# EasyEDA Pro project EasyEDA file.epro

# Schematic Schematic1
Board Name: Board1; Create Date: 2025-11-25; Page Name: P1; Project Name: Robodog; Schematic Name: Schematic1; Update Date: 2025-11-26; Company: there are too many boxes idk what to write here; Drawn: by Sahas; Page Size: Blueprint; Reviewed: by Hack Club; Version: V1.0
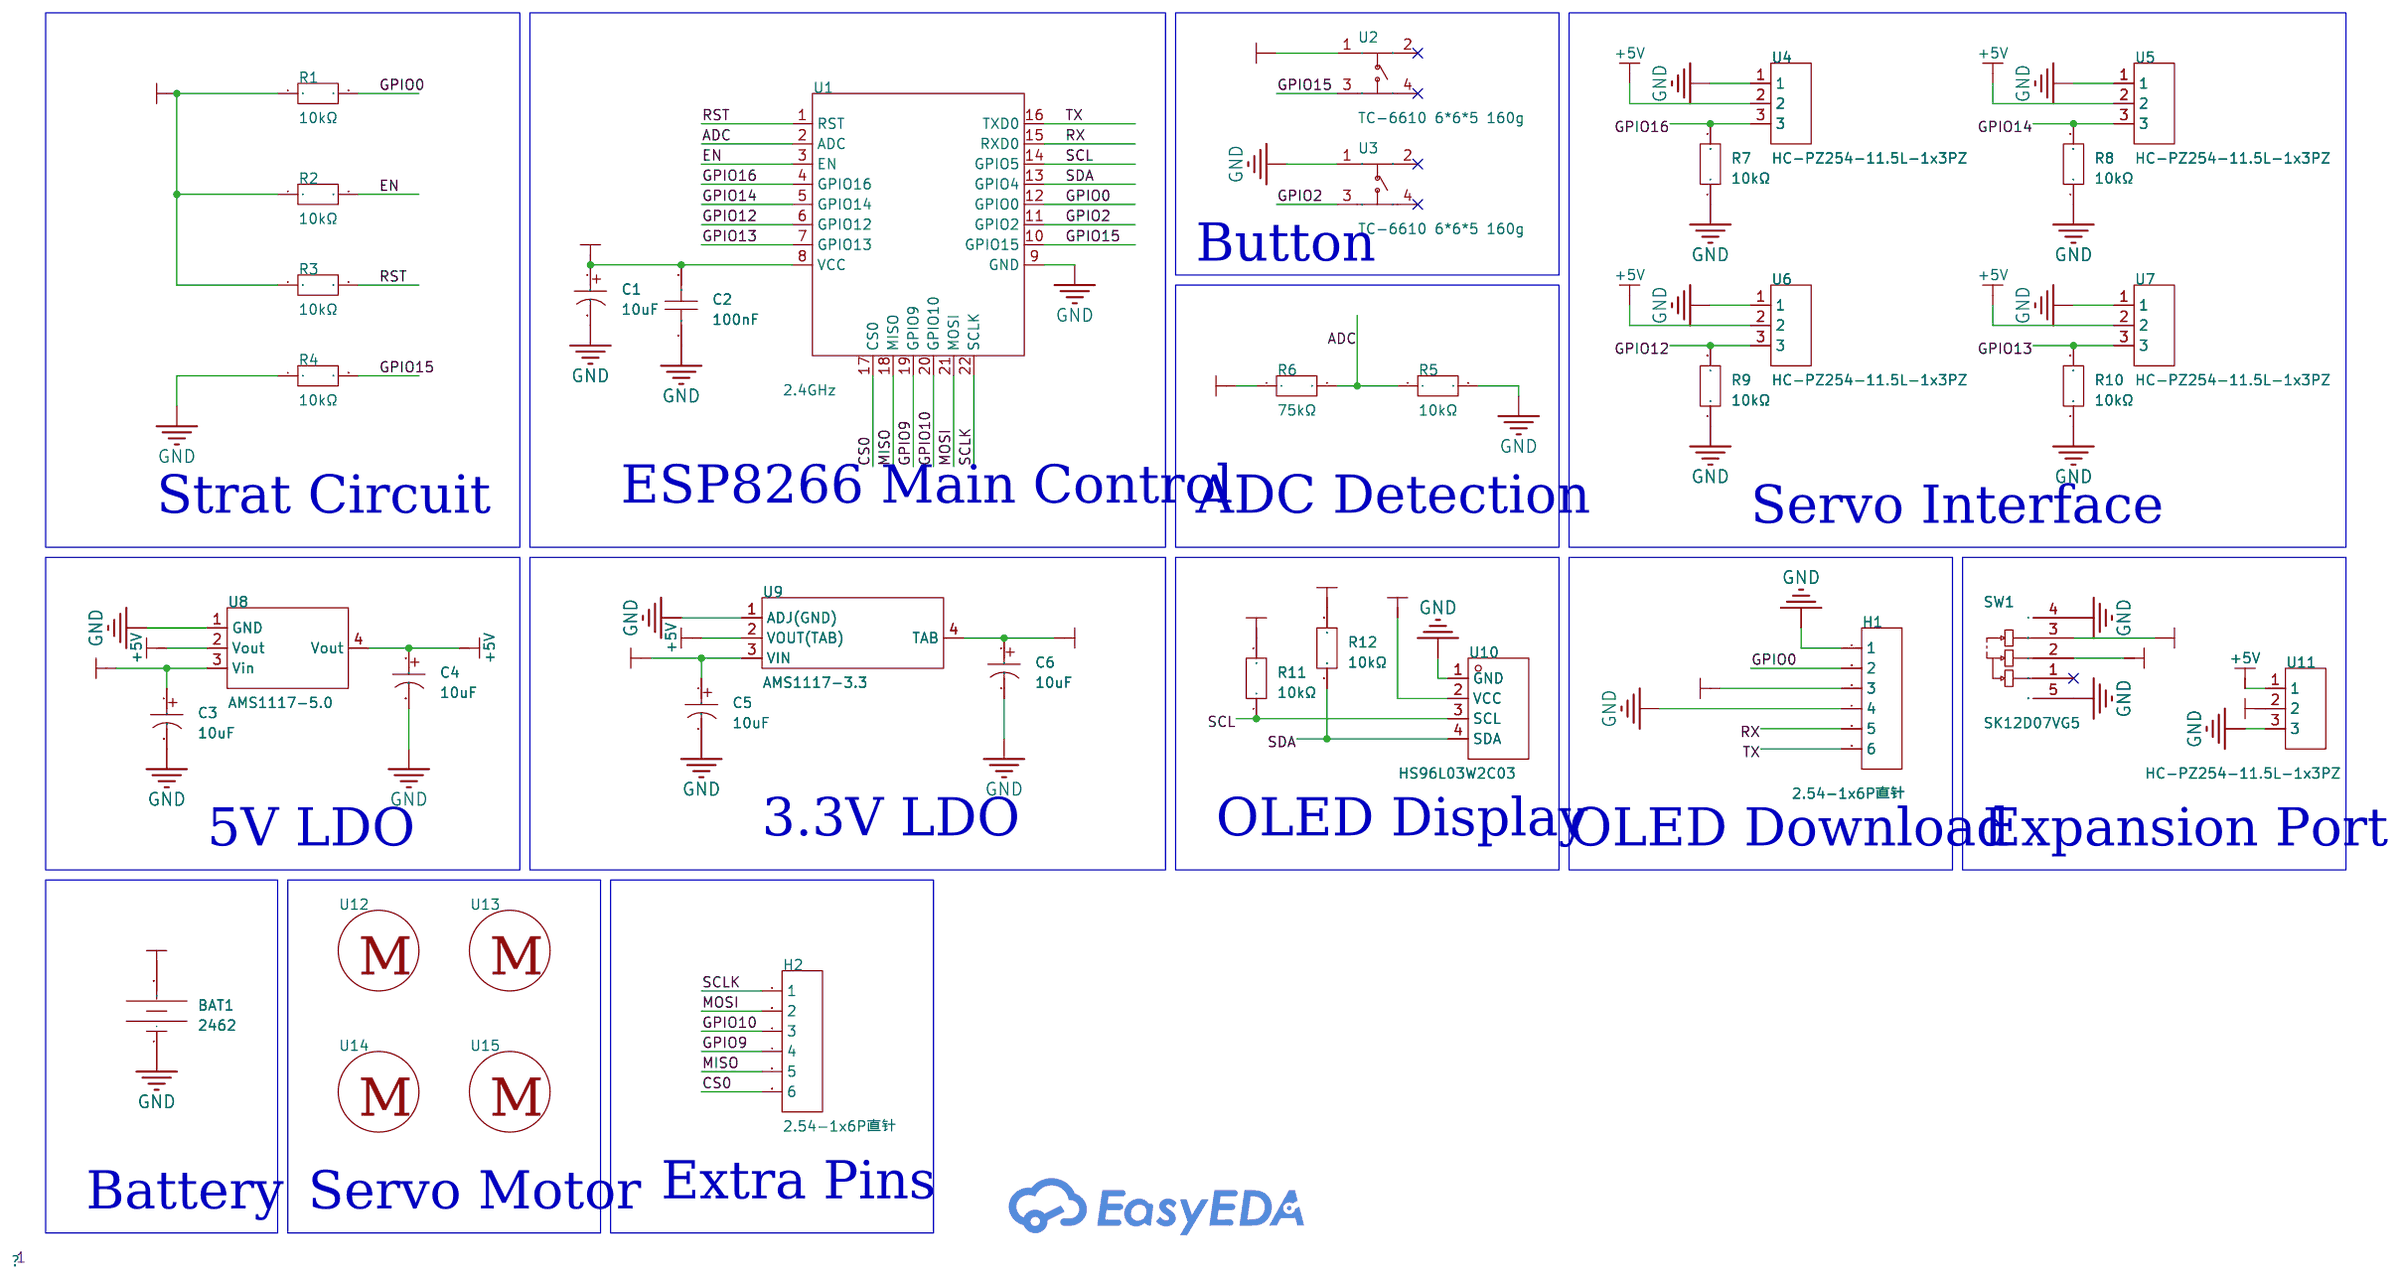
[diagram p0: schematic sheet]

## Parts
BAT1  2462  [BAT-TH_2P-P14.50_2462]
C1  10uF  [CAP-TH_BD4.0-P1.50-D0.8-FD]
C2  100nF  [CAP-TH_L4.2-W3.5-P2.54-D0.5]
C3  10uF  [CAP-TH_BD4.0-P1.50-D0.8-FD]
C4  10uF  [CAP-TH_BD4.0-P1.50-D0.8-FD]
C5  10uF  [CAP-TH_BD4.0-P1.50-D0.8-FD]
C6  10uF  [CAP-TH_BD4.0-P1.50-D0.8-FD]
H1  2.54-1x6P直针  [HDR-TH_6P-P2.54-V-M-1]
H2  2.54-1x6P直针  [HDR-TH_6P-P2.54-V-M-1]
R1  10kΩ  [RES-TH_BD2.4-L6.3-P10.30-D0.6]
R2  10kΩ  [RES-TH_BD2.4-L6.3-P10.30-D0.6]
R3  10kΩ  [RES-TH_BD2.4-L6.3-P10.30-D0.6]
R4  10kΩ  [RES-TH_BD2.4-L6.3-P10.30-D0.6]
R5  10kΩ  [RES-TH_BD2.4-L6.3-P10.30-D0.6]
R6  75kΩ  [RES-TH_BD2.4-L6.3-P10.30-D0.6]
R7  10kΩ  [RES-TH_BD2.4-L6.3-P10.30-D0.6]
R8  10kΩ  [RES-TH_BD2.4-L6.3-P10.30-D0.6]
R9  10kΩ  [RES-TH_BD2.4-L6.3-P10.30-D0.6]
R10  10kΩ  [RES-TH_BD2.4-L6.3-P10.30-D0.6]
R11  10kΩ  [RES-TH_BD2.4-L6.3-P10.30-D0.6]
R12  10kΩ  [RES-TH_BD2.4-L6.3-P10.30-D0.6]
SW1  SK12D07VG5  [SW-TH_SK12D07VG5-1]
U1  2.4GHz  [WIFIM-SMD_ESP-12F-ESP8266MOD]
U2  TC-6610 6*6*5 160g  [SW-TH_4P-L6.0-W6.0-P4.50-LS6.5]
U3  TC-6610 6*6*5 160g  [SW-TH_4P-L6.0-W6.0-P4.50-LS6.5]
U4  HC-PZ254-11.5L-1x3PZ  [HDR-TH_3P-P2.54-V-M]
U5  HC-PZ254-11.5L-1x3PZ  [HDR-TH_3P-P2.54-V-M]
U6  HC-PZ254-11.5L-1x3PZ  [HDR-TH_3P-P2.54-V-M]
U7  HC-PZ254-11.5L-1x3PZ  [HDR-TH_3P-P2.54-V-M]
U8  AMS1117-5.0  [SOT-223-4_L6.5-W3.5-P2.30-LS7.0-BR]
U9  AMS1117-3.3  [SOT-223-4_L6.5-W3.5-P2.30-LS7.0-BR]
U10  HS96L03W2C03  [OLED-TH_L27.8-W27.2-P2.54_C9900033791]
U11  HC-PZ254-11.5L-1x3PZ  [HDR-TH_3P-P2.54-V-M]
U12  -  [Servo]
U13  -  [Servo]
U14  -  [Servo]
U15  -  [Servo]

## Library data of the parts
BAT1 = 2462: Supplier Part: C3029547; Manufacturer: Keystone; Supplier Footprint: 插件; JLCPCB Part Class: Extended Part; Datasheet: https://atta.szlcsc.com/upload/public/pdf/source/20220627/187200C29C302DEABB66D4671A482C2E.pdf; Supplier: LCSC
C1 C3-C6 = KS106M025C07RR0VH2FP0: Capacitance:10uF Tolerance:±20% Tolerance:±20% Voltage Rating:25V Ripple Current:29mA@120Hz Equivalent Series Resistance(ESR):- Pin Spacing:1.5mm Diameter:4mm Height - Seated (Max):7mm Lifetime:1000hrs@105℃ Operating Temperature:-40℃~+105℃ Operating Tempe; LCSC Part Name: 10uF ±20% 25V; Supplier Part: C43351; Manufacturer: Chengx(承兴); Supplier Footprint: 插件,D4xL7mm; JLCPCB Part Class: Extended Part; Datasheet: https://item.szlcsc.com/datasheet/KS106M025C07RR0VH2FP0/44342.html; Supplier: LCSC; Tolerance: ±20%; Voltage Rating: 25V; Ripple Current: 29mA@120Hz; Pin Spacing: 1.5mm; Diameter: 4mm; Height - Seated (Max): 7mm; Lifetime: 1000hrs@105℃; Operating Temperature: -40℃~+105℃
C2 = 178MU0006: Capacitance:100nF Tolerance:±10% Tolerance:±10% Voltage Rating:50V Temperature Coefficient:X7R Pin Spacing:2.54mm; LCSC Part Name: 100nF ±10% 50V; Supplier Part: C5632430; Manufacturer: KNSCHA(科尼盛); Supplier Footprint: 插件,P=2.54mm; JLCPCB Part Class: Extended Part; Datasheet: https://item.szlcsc.com/datasheet/178MU0006/6552585.html; Supplier: LCSC; Tolerance: ±10%; Voltage Rating: 50V; Temperature Coefficient: X7R; Pin Spacing: 2.54mm
H1 H2 = 2.54-1x6P直针: Pin Structure:1x6P Pitch:2.54mm Row Spacing:- Circluar Pins/Square Pins:Pin Header Mounting Type:Through Hole Number of Rows:1 Number of Pins:6P Current Rating:3A Voltage Rating (Max):- Length of Mating Pin:6mm Insulation Height:2.5mm Length of End Connec; LCSC Part Name: 1x6P 间距:2.54mm 方针 直插; Supplier Part: C37208; Manufacturer: BOOMELE(博穆精密); Supplier Footprint: 插件,P=2.54mm; JLCPCB Part Class: Extended Part; Datasheet: https://item.szlcsc.com/datasheet/2.54-1x6P%25E7%259B%25B4%25E9%2592%2588/38187.html; Supplier: LCSC; Pin Structure: 1x6P; Pitch: 2.54mm; Circluar Pins/Square Pins: Pin Header; Mounting Type: Through Hole; Number of Rows: 1; Number of Pins: 6P; Current Rating: 3A; Length of Mating Pin: 6mm; Insulation Height: 2.5mm; Length of End Connection Pin: 3mm; Contact Material: Brass; Contact Plating: Gold; Operating Temperature: -40℃~+105℃; Color: Black
R1-R5 R7-R12 = RN1/4W10KFT/BA1: Type:Metal Film Resistors Resistance:10kΩ Tolerance:±1% Tolerance:±1% Voltage-Supply(Max):250V Power(Watts):250mW Temperature Coefficient:±50ppm/℃ Temperature Coefficient:±50ppm/℃ Operating Temperature:-55℃~+125℃ Operating Temperature:-55℃~+125℃; LCSC Part Name: 10kΩ ±1% 250mW 金属膜电阻; Supplier Part: C410695; Manufacturer: Tyohm(幸亚电阻); Supplier Footprint: 插件,D2.4xL6.5mm; JLCPCB Part Class: Extended Part; Datasheet: https://atta.szlcsc.com/upload/public/pdf/source/20250211/2C0505E212032D72CE625B2E6B5197BA.pdf; Supplier: LCSC; Type: Metal Film Resistors; Tolerance: ±1%; Voltage-Supply(Max): 250V; Power(Watts): 250mW; Temperature Coefficient: ±50ppm/℃; Operating Temperature: -55℃~+125℃
R6 = RN 1/4W 75K F T/B A1: Type:Metal Film Resistor Resistance:75kΩ Tolerance:±1% Tolerance:±1% Voltage-Supply(Max):250V Power(Watts):250mW Temperature Coefficient:±50ppm/℃ Temperature Coefficient:±50ppm/℃ Operating Temperature:-55℃~+125℃ Operating Temperature:-55℃~+125℃; LCSC Part Name: 75kΩ ±1% 250mW 金属膜电阻; Supplier Part: C410583; Manufacturer: Tyohm(幸亚电阻); Supplier Footprint: 插件,D2.4xL6.4mm; JLCPCB Part Class: Extended Part; Datasheet: https://item.szlcsc.com/datasheet/RN%25201%252F4W%252075K%2520F%2520T%252FB%2520A1/401504.html; Supplier: LCSC; Type: Metal Film Resistor; Tolerance: ±1%; Voltage-Supply(Max): 250V; Power(Watts): 250mW; Temperature Coefficient: ±50ppm/℃; Operating Temperature: -55℃~+125℃
SW1 = SK12D07VG5: Circuit:SPDT Actuator Style:- Termination Style:PC Pin Length:8.7mm Width:4.4mm Switch Height:4.7mm Mounting Type:- Actuator Color:- Current Rating:500mA Voltage Rating:50V Life:5000 Cycles Operating Temperature:-10℃~+50℃ Operating Temperature:-10℃~+50℃; LCSC Part Name: 两档位卧式拨动开关,柄长5MM; Supplier Part: C431548; Manufacturer: SHOU HAN(首韩); Supplier Footprint: 插件,8.7x4.4mm; JLCPCB Part Class: Extended Part; Datasheet: https://item.szlcsc.com/datasheet/SK12D07VG5/427905.html; Supplier: LCSC; Circuit: SPDT; Termination Style: PC Pin; Length: 8.7mm; Width: 4.4mm; Switch Height: 4.7mm; Current Rating: 500mA; Voltage Rating: 50V; Life: 5000 Cycles; Operating Temperature: -10℃~+50℃
U1 = ESP-12F(ESP8266MOD): Core Processor:ESP8266 chip Wireless Standard:- Support Interface:GPIO；UART；I2C；PWM；SPI；ADC Frequency:2.4GHz Antenna Type:On-board PCB antenna Output Power:16dBm Output Power:16dBm Operating Voltage:3.3V Operating Voltage:3.3V Receive  Current:120mA Send; LCSC Part Name: 完整的802.11b/g/nWi-FiSoC模块 屏蔽罩上的丝印是：ESP8266MOD，ESP8266EX串口WIFI; Supplier Part: C82891; Manufacturer: Ai-Thinker(安信可); Supplier Footprint: SMD,16x24mm; JLCPCB Part Class: Extended Part; Datasheet: https://atta.szlcsc.com/upload/public/pdf/source/20210219/C82891_ABD84A460F4F056A2757267CCCA4B508.pdf; Supplier: LCSC; Core Processor: ESP8266 chip; Support Interface: GPIO；UART；I2C；PWM；SPI；ADC; Antenna Type: On-board PCB antenna; Output Power: 16dBm; Operating Voltage: 3.3V; Receive  Current: 120mA; Send  Current: 170mA; Sensitivity: -90dBm; Operating Temperature: -40℃~+85℃
U2 U3 = TC-6610 6*6*5 160g: Circuit:SPST Actuator Style:Round Button Operating Force:1.6N Mounting Type:Through Hole with Bracket:Without Bracket Contact Current:50mA Voltage Rating:12V Actuator/Cap Color:Black Life:50,000 Cycles Operating Temperature:-20℃~+70℃ Operating Temperature; Supplier Part: C7528706; Manufacturer: FG(富港); Supplier Footprint: 插件-4P,6x6mm; JLCPCB Part Class: Extended Part; Datasheet: https://item.szlcsc.com/datasheet/TC-6610%25206*6*5%2520160g/8628028.html; Supplier: LCSC; Circuit: SPST; Actuator Style: Round Button; Operating Force: 1.6N; Mounting Type: Through Hole; with Bracket: Without Bracket; Contact Current: 50mA; Voltage Rating: 12V; Actuator/Cap Color: Black; Life: 50,000 Cycles; Operating Temperature: -20℃~+70℃
U4-U7 U11 = HC-PZ254-11.5L-1x3PZ: Pin Structure:1x3P Pitch:2.54mm Row Spacing:- Circluar Pins/Square Pins:Pin Header Mounting Type:Through Hole Number of Rows:1 Number of Pins:3P Current Rating:3A Voltage Rating (Max):- Length of Mating Pin:6mm Insulation Height:2.5mm Length of End Connec; LCSC Part Name: 1x3P 间距:2.54mm 方针 直插; Supplier Part: C27985188; Manufacturer: HC(虹成电子); Supplier Footprint: 插件,P=2.54mm; JLCPCB Part Class: Extended Part; Datasheet: https://item.szlcsc.com/datasheet/HC-PZ254-11.5L-1x3PZ/29721146.html; Supplier: LCSC; Pin Structure: 1x3P; Pitch: 2.54mm; Circluar Pins/Square Pins: Pin Header; Mounting Type: Through Hole; Number of Rows: 1; Number of Pins: 3P; Current Rating: 3A; Length of Mating Pin: 6mm; Insulation Height: 2.5mm; Length of End Connection Pin: 3mm; Contact Material: Brass; Contact Plating: Gold; Operating Temperature: -40℃~+105℃; Color: Black
U8 = AMS1117-5.0_C5345984: Output Type:Fixed Voltage - Supply:18V Output Voltage:5V Output Voltage:5V Output Current:1A Voltage Dropout:20mV@(1A) standby current:12mA Operating Temperature:0℃~+125℃@(Ta) Operating Temperature:0℃~+125℃@(Ta) Output Configuration:Positive Number of Out; LCSC Part Name: IO:1A VO:5V VI:18V; Supplier Part: C5345984; Manufacturer: HXY MOSFET(华轩阳电子); Supplier Footprint: SOT-223; JLCPCB Part Class: Extended Part; Datasheet: https://item.szlcsc.com/datasheet/AMS1117-5.0/6125821.html; Supplier: LCSC; Output Type: Fixed; Voltage - Supply: 18V; Output Voltage: 5V; Output Current: 1A; Voltage Dropout: 20mV@(1A); standby current: 12mA; Operating Temperature: 0℃~+125℃@(Ta); Output Configuration: Positive; Number of Outputs: 1
U9 = AMS1117-3.3_C347222: Output Type:Fixed Voltage - Supply:12V Output Voltage:3.3V Output Voltage:3.3V Output Current:1A Power Supply Rejection Ratio (PSRR):60dB@(120Hz) Voltage Dropout:1.3V@(1A) standby current:5mA Noise:0.003%Vout Features:Over Current Protection Operating Tem; LCSC Part Name: 输出:3.3V 电流:1A 耐压:12V; Supplier Part: C347222; Manufacturer: UMW(友台半导体); Supplier Footprint: SOT-223; JLCPCB Part Class: Extended Part; Datasheet: https://item.szlcsc.com/datasheet/AMS1117-3.3/323882.html; Supplier: LCSC; Output Type: Fixed; Voltage - Supply: 12V; Output Voltage: 3.3V; Output Current: 1A; Power Supply Rejection Ratio (PSRR): 60dB@(120Hz); Voltage Dropout: 1.3V@(1A); standby current: 5mA; Noise: 0.003%Vout; Features: Over Current Protection; Operating Temperature: -40℃~+125℃; Output Configuration: Positive; Number of Outputs: 1
U10 = HS96L03W2C03: Main Control Chip:SSD1315 Interface Type:I2C Size:0.96 Pixel Resolution:128x64 Operating Temperature:-40℃~+70℃ Operating Temperature:-40℃~+70℃; LCSC Part Name: 0.96寸OLED显示屏窄白光IIC; Supplier Part: C5248080; Manufacturer: HS(汉昇); JLCPCB Part Class: Extended Part; Datasheet: https://atta.szlcsc.com/upload/public/pdf/source/20230627/763D01F79A90007632F098068C7C8AD9.pdf; Supplier: LCSC; Main Control Chip: SSD1315; Interface Type: I2C; Size: 0.96; Pixel Resolution: 128x64; Operating Temperature: -40℃~+70℃
U12-U15 = Servo

## Nets
+3.3V: C1.1 C2.2 C6.1 H1.3 R1.1 R2.1 R3.1 R11.2 R12.2 U1.8(VCC) U2.1 U9.4(TAB) U10.2(VCC)
+5V: C4.1 U4.2 U5.2 U6.2 U7.2 U8.2(Vout) U8.4(Vout) U9.2(VOUT(TAB)) U11.1
GND: BAT1.1(-) C1.2 C2.1 C3.2 C4.2 C5.2 C6.2 H1.1 H1.4 R4.1 R5.2 R7.1 R8.1 R9.1 R10.1 SW1.4 SW1.5 U1.9(GND) U3.1 U4.1 U5.1 U6.1 U7.1 U8.1(GND) U9.1(ADJ(GND)) U10.1(GND) U11.3
VBAT: C3.1 C5.1 R6.1 SW1.3 U8.3(Vin) U9.3(VIN)
VIN: BAT1.2(+) SW1.2 U11.2
ADC: R5.1 R6.2 U1.2(ADC)
CS0: H2.6 U1.17(CS0)
EN: R2.2 U1.3(EN)
GPIO0: H1.2 R1.2 U1.12(GPIO0)
GPIO2: U1.11(GPIO2) U3.3
GPIO9: H2.4 U1.19(GPIO9)
GPIO10: H2.3 U1.20(GPIO10)
GPIO12: R9.2 U1.6(GPIO12) U6.3
GPIO13: R10.2 U1.7(GPIO13) U7.3
GPIO14: R8.2 U1.5(GPIO14) U5.3
GPIO15: R4.2 U1.10(GPIO15) U2.3
GPIO16: R7.2 U1.4(GPIO16) U4.3
MISO: H2.5 U1.18(MISO)
MOSI: H2.2 U1.21(MOSI)
RST: R3.2 U1.1(RST)
RX: H1.5 U1.15(RXD0)
SCL: R11.1 U1.14(GPIO5) U10.3(SCL)
SCLK: H2.1 U1.22(SCLK)
SDA: R12.1 U1.13(GPIO4) U10.4(SDA)
TX: H1.6 U1.16(TXD0)

Not connected (* = marked no-connect by the designer): SW1 1*; U2 2* 4*; U3 2* 4*

## Notes on the sheet
- Button
- ESP8266 Main Control
- Strat Circuit
- ADC Detection
- Servo Interface
- 3.3V LDO
- OLED Display
- 5V LDO
- OLED Download
- Expansion Port
- Extra Pins
- Battery
- Servo Motor

# Board PCB1
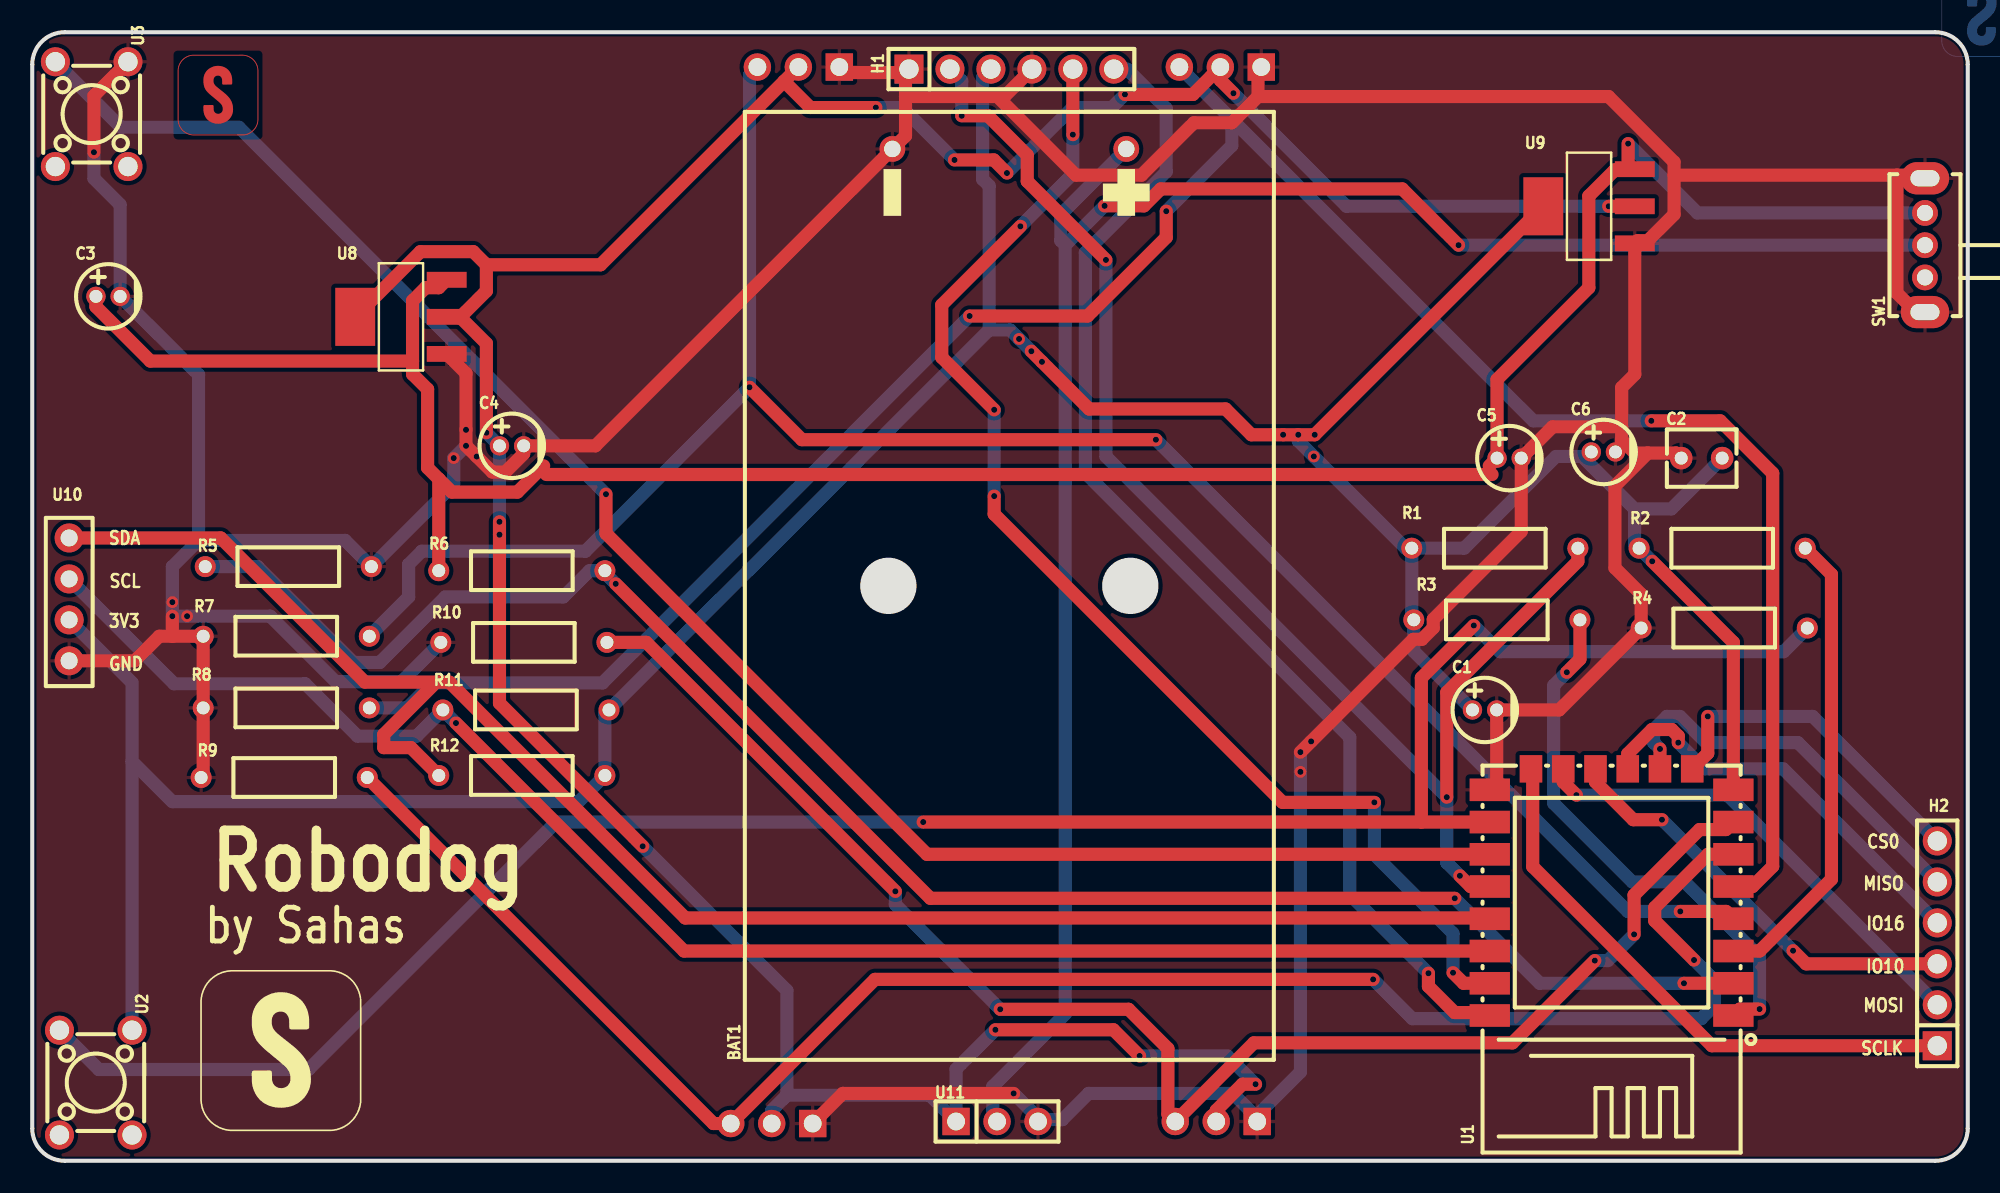
[diagram p1: board, top side]
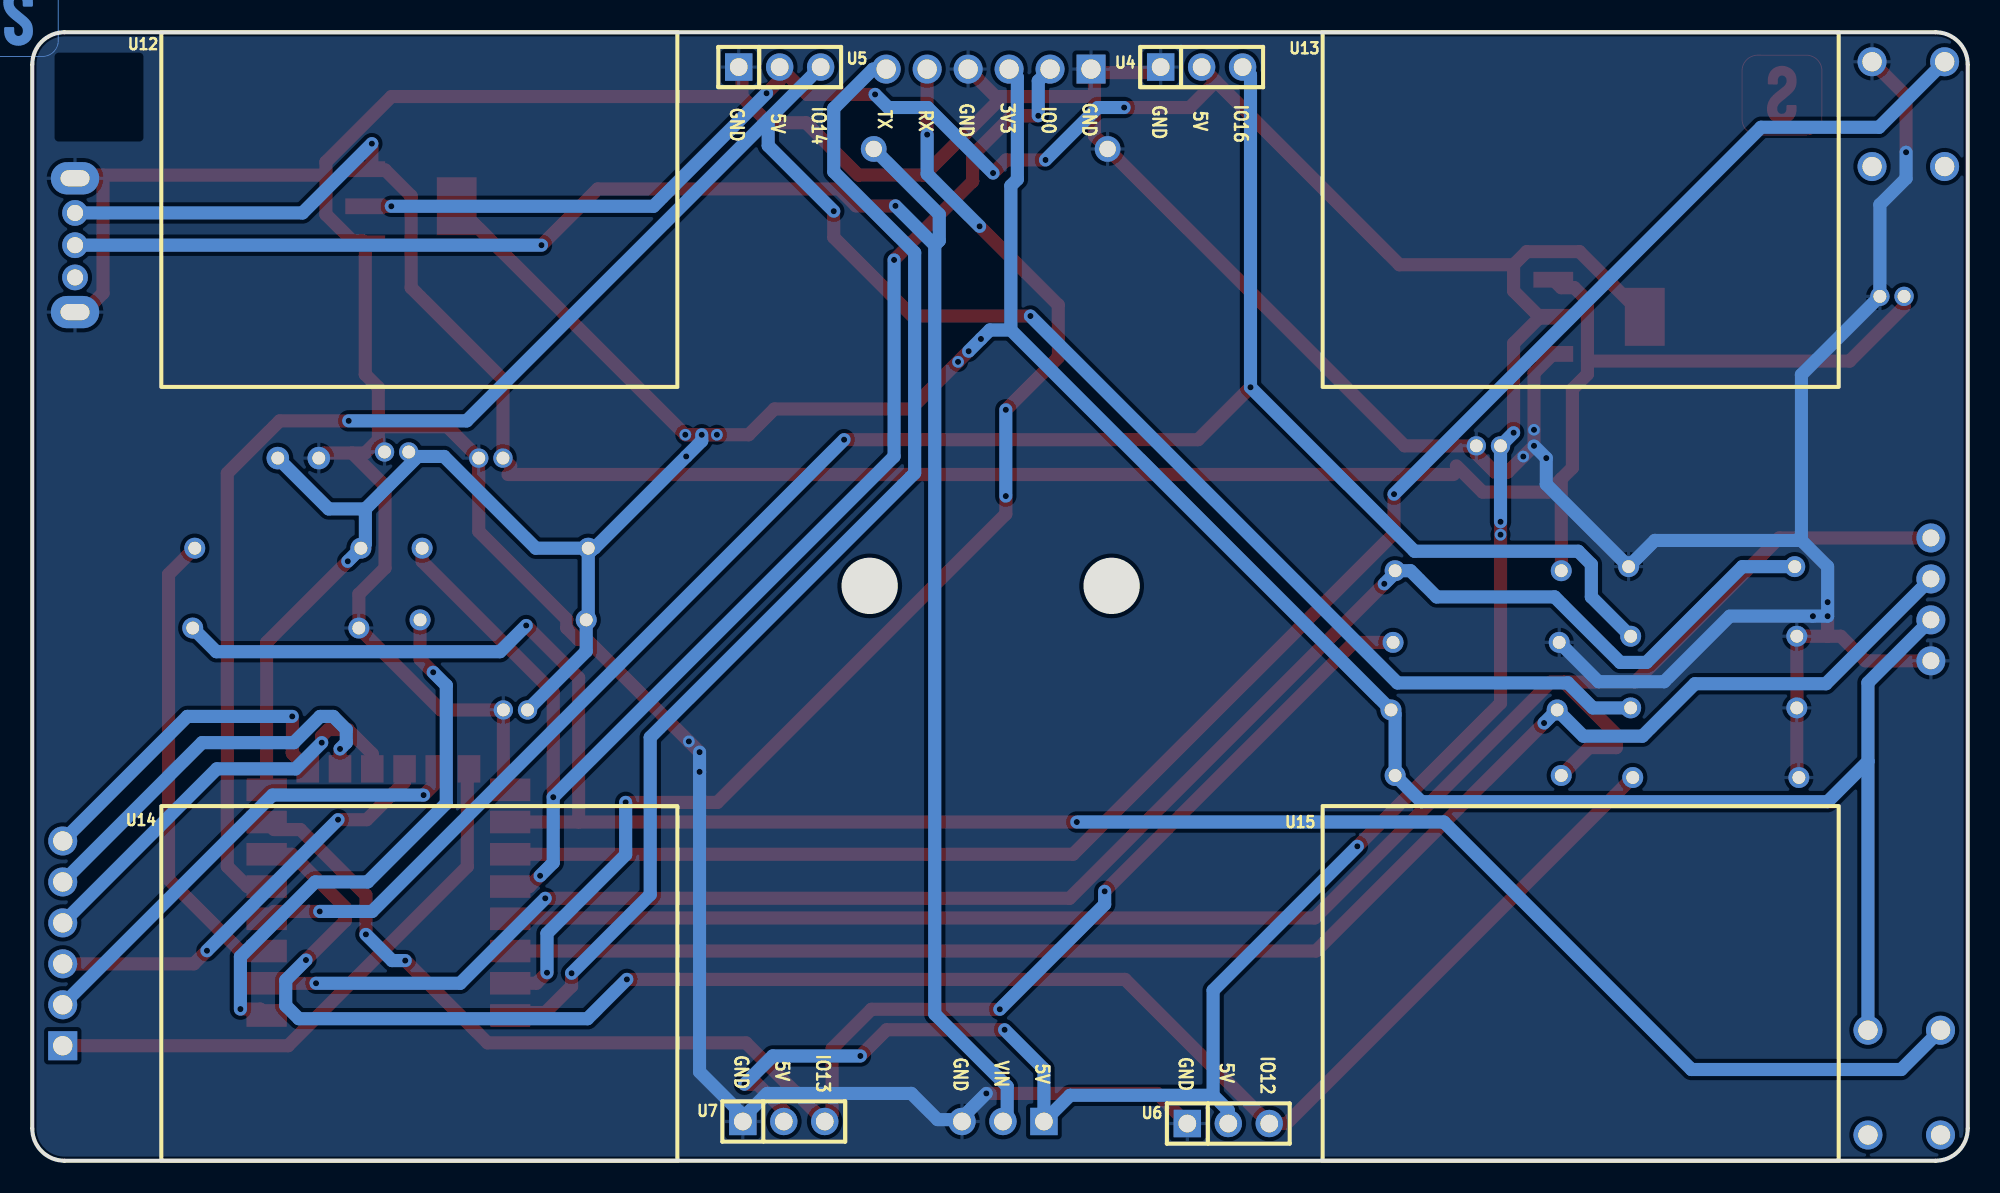
[diagram p2: board, bottom side, seen from below]

Outline 120 x 70 mm; copper layers: Top Layer, Bottom Layer. Coordinates in mm from the lower left corner of the outline.
Outline path: 0,68 0,2 arc(0.59,0.59) 2,0 118,0 arc(119.41,0.59) 120,2 120,68 arc(119.41,69.41) 118,70 2,70 arc(0.59,69.41) 0,68
Stack: Top Layer 0.035mm / Dielectric1 1.51mm FR4 er 4.5 / Bottom Layer 0.035mm

## Design rules (mm)
template: Custom Config
spacing copperThickness1oz (default): track to track 0.381, other pairs 0.152 to 0.3
spacing copperThickness2oz: track to track 0.762, other pairs 0.152 to 0.762
track width copperThickness1oz: min 0.508, default 0.508, max 2.54
track width copperThickness2oz (default): min 0.762, default 0.813, max 2.54
differential pair differentialPair (default): width min 0.127, default 0.254, max 2.54; gap min 0.152, default 0.152
via viaSize (default): diameter min 0.732, default 0.732, max 10; hole min 0.381, default 0.381, max 6.3

## Placement (name value [footprint] x y rotation side)
BAT1  2462  [BAT-TH_2P-P14.50_2462]  60.58 62.76 90 top
C1  10uF  [CAP-TH_BD4.0-P1.50-D0.8-FD]  90.04 27.96 0 top
C2  100nF  [CAP-TH_L4.2-W3.5-P2.54-D0.5]  103.5 43.58 0 top
C3  10uF  [CAP-TH_BD4.0-P1.50-D0.8-FD]  4.7 53.62 0 top
C4  10uF  [CAP-TH_BD4.0-P1.50-D0.8-FD]  29.72 44.35 0 top
C5  10uF  [CAP-TH_BD4.0-P1.50-D0.8-FD]  91.57 43.58 0 top
C6  10uF  [CAP-TH_BD4.0-P1.50-D0.8-FD]  97.41 43.97 0 top
H1  2.54-1x6P直针  [HDR-TH_6P-P2.54-V-M-1]  60.71 67.71 0 top
H2  2.54-1x6P直针  [HDR-TH_6P-P2.54-V-M-1]  118.11 13.48 90 top
R1  10kΩ  [RES-TH_BD2.4-L6.3-P10.30-D0.6]  90.68 38 0 top
R2  10kΩ  [RES-TH_BD2.4-L6.3-P10.30-D0.6]  104.78 38 0 top
R3  10kΩ  [RES-TH_BD2.4-L6.3-P10.30-D0.6]  90.81 33.55 0 top
R4  10kΩ  [RES-TH_BD2.4-L6.3-P10.30-D0.6]  104.9 33.04 0 top
R5  10kΩ  [RES-TH_BD2.4-L6.3-P10.30-D0.6]  15.88 36.85 0 top
R6  75kΩ  [RES-TH_BD2.4-L6.3-P10.30-D0.6]  30.35 36.6 0 top
R7  10kΩ  [RES-TH_BD2.4-L6.3-P10.30-D0.6]  15.75 32.53 0 top
R8  10kΩ  [RES-TH_BD2.4-L6.3-P10.30-D0.6]  15.75 28.09 0 top
R9  10kΩ  [RES-TH_BD2.4-L6.3-P10.30-D0.6]  15.62 23.77 0 top
R10  10kΩ  [RES-TH_BD2.4-L6.3-P10.30-D0.6]  30.48 32.15 0 top
R11  10kΩ  [RES-TH_BD2.4-L6.3-P10.30-D0.6]  30.61 27.96 0 top
R12  10kΩ  [RES-TH_BD2.4-L6.3-P10.30-D0.6]  30.35 23.9 0 top
SW1  SK12D07VG5  [SW-TH_SK12D07VG5-1]  117.35 56.79 90 top
U1  2.4GHz  [WIFIM-SMD_ESP-12F-ESP8266MOD]  97.92 16.66 90 top
U2  TC-6610 6*6*5 160g  [SW-TH_4P-L6.0-W6.0-P4.50-LS6.5]  3.94 4.85 270 top
U3  TC-6610 6*6*5 160g  [SW-TH_4P-L6.0-W6.0-P4.50-LS6.5]  3.68 64.92 270 top
U4  HC-PZ254-11.5L-1x3PZ  [HDR-TH_3P-P2.54-V-M]  47.5 67.84 180 bottom
U5  HC-PZ254-11.5L-1x3PZ  [HDR-TH_3P-P2.54-V-M]  73.66 67.84 180 bottom
U6  HC-PZ254-11.5L-1x3PZ  [HDR-TH_3P-P2.54-V-M]  45.85 2.31 180 bottom
U7  HC-PZ254-11.5L-1x3PZ  [HDR-TH_3P-P2.54-V-M]  73.41 2.44 180 bottom
U8  AMS1117-5.0  [SOT-223-4_L6.5-W3.5-P2.30-LS7.0-BR]  22.86 52.35 0 top
U9  AMS1117-3.3  [SOT-223-4_L6.5-W3.5-P2.30-LS7.0-BR]  96.52 59.2 0 top
U10  HS96L03W2C03  [OLED-TH_L27.8-W27.2-P2.54_C9900033791]  2.29 34.82 90 top
U11  HC-PZ254-11.5L-1x3PZ  [HDR-TH_3P-P2.54-V-M]  59.82 2.44 0 top
U12  -  [Servo]  112 70 180 bottom
U13  -  [Servo]  40 70 180 bottom
U14  -  [Servo]  112 22 180 bottom
U15  -  [Servo]  40 22 180 bottom

## Footprints (pads in the part's own frame, mm; a bottom-side part is the same pattern mirrored in y, then rotated)
BAT-TH_2P-P14.50_2462
  round 1.6 hole 1.02: 1(0,7.25) 2(0,-7.25)
CAP-TH_BD4.0-P1.50-D0.8-FD
  round 1.2 hole 0.8: 1(-0.75,0) 2(0.75,0)
CAP-TH_L4.2-W3.5-P2.54-D0.5
  round 1.4 hole 0.8: 1(-1.27,0) 2(1.27,0)
HDR-TH_3P-P2.54-V-M
  rect 1.7x1.7 hole 1.1: 1(-2.54,0)
  round 1.7 hole 1.1: 2(0,0) 3(2.54,0)
HDR-TH_6P-P2.54-V-M-1
  rect 1.8x1.8 hole 1.2: 1(-6.35,0)
  round 1.8 hole 1.2: 2(-3.81,0) 3(-1.27,0) 4(1.27,0) 5(3.81,0) 6(6.35,0)
OLED-TH_L27.8-W27.2-P2.54_C9900033791
  round 1.8 hole 1.05: 1(-3.81,0) 2(-1.27,0) 3(1.27,0) 4(3.81,0)
RES-TH_BD2.4-L6.3-P10.30-D0.6
  round 1.3 hole 0.8: 1(-5.15,0) 2(5.15,0)
SOT-223-4_L6.5-W3.5-P2.30-LS7.0-BR
  rect 2.47x0.98 smd: 1(2.835,-2.3) 2(2.835,0) 3(2.835,2.3)
  rect 2.47x3.6 smd: 4(-2.835,0)
SW-TH_4P-L6.0-W6.0-P4.50-LS6.5
  round 1.8 hole 1.2: 1(-3.25,2.25) 2(3.25,2.25) 3(-3.25,-2.25) 4(3.25,-2.25)
SW-TH_SK12D07VG5-1
  oval 1.6x1.6 hole 1: 1(-2,0) 2(0,0) 3(2,0)
  oval 2x3 hole 1x1.8: 4(4.15,0) 5(-4.15,0)
WIFIM-SMD_ESP-12F-ESP8266MOD
  rect 1.4x2.5 smd: 1(-7.651,-7.551) 2(-5.651,-7.551) 3(-3.651,-7.551) 4(-1.651,-7.551) 5(0.349,-7.551) 6(2.349,-7.551) 7(4.349,-7.551) 8(6.349,-7.551) 9(6.349,7.548) 10(4.349,7.55) 11(2.349,7.551) 12(0.349,7.551) 13(-1.651,7.55) 14(-3.651,7.551) 15(-5.651,7.551) 16(-7.651,7.551)
  rect 1.7x1.4 smd: 17(7.651,-5) 18(7.649,-3.002) 19(7.649,-1.004) 20(7.649,0.998) 21(7.649,2.997) 22(7.651,4.997)

## Nets
As in the schematic.

Pads without a net: SW1 1; U2 2 4; U3 2 4

## Via types
v1: diameter 0.732, hole 0.381, Top Layer to Bottom Layer, 74 vias

## Routing (per net, layer and track width the routed paths; a pad name or vN(x,y) marks a point on that pad's centre or on a via; arc(x,y) is an arc through that point)
+3.3V: length 221.7
  Top Layer w0.813: v1(61.94,50.21) v1(62.6,49.56) 65.53,46.63 73.98,46.63 75.58,45.03 v1(77.55,45.03) v1(78.49,45.03) v1(79.51,45.03) U9.4 ; v1(100.44,37.18) 105.47,32.15 U1.8
  Bottom Layer w0.813: C6.1 96.38,43.69 96.09,43.69 ; 99.35,40.43 101.63,40.43 C2.2 ; 99.35,40.43 99.35,38.28 R2.1 v1(100.44,37.18) ; 99.35,40.43 96.09,43.69 ; U10.2 6.19,29.65 6.19,24.77 ; 59.33,51.53 R11.2 35.5,27.71 R12.2 33.88,22.27 8.69,22.27 6.19,24.77 ; 59.33,51.53 59.33,60.47 58.92,60.88 58.92,67.2 H1.3 ; 59.33,51.53 60.62,51.53 v1(61.18,50.97) v1(61.94,50.21) ; R1.1 88.78,38 94.47,43.69 96.09,43.69 ; R1.1 85.53,33.68 R3.1 85.66,31.6 C1.1 ; R1.1 85.15,38 v1(79.46,43.69) 78.49,44.65 v1(78.49,45.03) ; 6.19,24.77 U2.1
+5V: length 199.2
  Top Layer w0.813: U8.4 24.07,56.39 27.34,56.39 28.16,55.58 ; v1(68.66,6.5) 67.03,8.13 v1(59.72,8.13) ; 46.61,66.96 35.23,55.58 28.16,55.58 ; 46.61,66.96 U4.2 ; 46.61,66.96 48.24,65.33 v1(52.3,65.33) ; v1(28.16,45.16) 28.16,50.7 26.53,52.33 ; v1(67.75,66.14) 71.96,66.14 U5.2 73.66,67.03 v1(74.47,66.22) ; 26.53,52.33 25.72,52.33 U8.2 ; 26.53,52.33 28.16,53.95 28.16,55.58 ; v1(60.43,61.27) 59.62,62.08 v1(57.18,62.08) ; v1(37.85,19.5) 28.97,28.38 v1(28.97,38.83) v1(28.97,39.64) ; v1(97.74,59.2) U9.2 ; U7.2 73.41,3.12 75.03,4.75 v1(75.84,4.75)
  Bottom Layer w0.813: v1(68.66,6.5) 74.09,6.5 v1(75.84,4.75) ; v1(97.74,59.2) 81.48,59.2 v1(74.47,66.22) ; v1(57.18,62.08) 53.93,65.33 v1(52.3,65.33) ; 46.79,4.06 55.65,4.06 57.28,2.44 57.28,5.69 v1(59.72,8.13) ; 46.79,4.06 45.85,3.12 U6.2 ; 46.79,4.06 46.79,10.56 v1(37.85,19.5) ; v1(28.97,39.64) C4.1 v1(28.16,45.16) ; v1(67.75,66.14) 66.93,65.33 64.49,65.33 v1(60.43,61.27)
GND: length 371.6
  Top Layer w0.813: 101.79,61.14 115.61,61.14 ; 101.79,61.14 101.79,58.7 100.17,57.07 99.52,57.07 U9.1 99.35,48.78 98.54,47.96 98.54,45.53 ; 101.79,61.14 101.79,61.95 97.73,66.01 76,66.01 ; 115.61,61.14 117.15,61.14 SW1.4 ; 115.61,61.14 115.61,53.82 116.42,53.01 116.98,53.01 SW1.5 ; U4.1 50.38,67.5 54.14,67.5 ; 54.14,66.01 54.14,63.57 BAT1.1 34.91,44.35 C4.2 30.47,43.86 29.33,42.72 28.52,42.72 v1(27.56,43.68) v1(26.89,44.35) v1(26.89,45.34) 26.89,48.85 U8.1 ; 54.14,66.01 54.14,67.5 ; 54.14,66.01 59.83,66.01 ; 54.14,67.5 H1.1 ; 98.54,45.53 98.54,44.71 ; 98.54,45.53 94.26,45.53 C5.2 92.32,39.04 86.86,33.58 86.86,33.05 86.16,32.34 85.62,32.34 v1(79.29,26.01) v1(78.63,25.35) ; 98.54,44.71 99.35,43.9 100.17,43.9 ; 98.54,44.71 98.54,44.35 C6.2 ; 76,66.01 74.37,64.39 72.02,64.39 68.77,61.14 64.71,61.14 59.83,66.01 ; 76,66.01 76,67.64 U5.1 ; v1(3.82,62.56) 3.82,66.06 U3.1 ; 10.47,23.77 10.6,23.9 R8.1 R7.1 8.69,32.53 ; v1(60.85,4.18) 50.25,4.18 U6.1 ; 100.17,43.9 98.13,41.86 98.13,36.77 99.75,35.14 R4.1 94.67,27.96 C1.2 90.79,23.43 U1.9 ; 100.17,43.9 101.92,43.9 102.24,43.58 ; 59.83,66.01 60.27,66.01 H1.4 ; 8.69,32.53 7.87,32.53 6.35,31.01 U10.1 ; 8.69,32.53 v1(8.69,33.78)
  Bottom Layer w0.813: 76.06,2.55 U7.1 ; 76.06,2.55 74.44,4.18 65.49,4.18 63.87,2.55 62.47,2.55 ; 76.06,2.55 76.06,2.94 78.63,5.51 v1(78.63,24.12) v1(78.63,25.35) ; v1(26.89,44.35) v1(26.13,43.58) 26.13,41.96 R5.2 19.4,38.48 10.31,38.48 ; 10.31,38.48 10.31,48.75 C3.2 5.45,59.31 3.82,60.93 v1(3.82,62.56) ; 10.31,38.48 8.69,36.85 v1(8.69,34.65) v1(8.69,33.78) v1(9.6,33.78) 14.76,33.78 18.82,29.72 22.89,29.72 R10.1 ; 62.47,2.55 U11.3 ; 62.47,2.55 v1(60.85,4.18)
VBAT: length 152.5
  Top Layer w0.813: 25.69,54.65 25.2,54.16 24.39,54.16 23.58,53.34 23.58,49.6 ; 98.94,61.47 v1(98.94,63.09) ; 98.94,61.47 98.13,61.47 96.51,59.84 96.51,54.15 90.82,48.46 C5.1 90.33,43.1 ; 98.94,61.47 U9.3 ; 31.88,42.57 90.51,42.57 ; 25.2,42.29 26.02,41.48 30.08,41.48 31.71,43.1 ; 25.2,42.29 24.51,42.98 24.51,47.86 23.58,48.79 23.58,49.6 ; 25.2,42.29 25.2,36.6 ; 23.58,49.6 7.32,49.6 3.95,52.98 C3.1
  Bottom Layer w0.813: SW1.3 103.24,58.79 v1(98.94,63.09)
VIN: length 120.3
  Top Layer w0.813: v1(88.43,56.79) 84.94,60.28 69.97,60.28 68.92,59.23 v1(66.48,59.23)
  Bottom Layer w0.813: U11.2 59.55,2.7 59.55,4.61 64.04,9.1 64.04,56.79 ; 64.04,56.79 63.76,57.07 63.76,58.7 BAT1.2 ; 64.04,56.79 v1(66.48,59.23) ; v1(88.43,56.79) SW1.2
ADC: length 110.3
  Top Layer w0.813: v1(36.18,35.79) 55.68,16.28 v1(88.19,16.28) ; v1(102.41,11.01) U1.2
  Bottom Layer w0.813: 35.36,36.6 34.55,36.6 32.92,34.97 25.61,34.97 21.55,30.91 19.92,30.91 13.98,36.85 R5.1 ; 35.36,36.6 R6.2 ; 35.36,36.6 v1(36.18,35.79) ; v1(88.19,16.28) 93.46,11.01 v1(102.41,11.01)
CS0: length 21.1
  Top Layer w0.813: U1.17 103.88,25.27 v1(103.88,27.56)
  Bottom Layer w0.813: v1(103.88,27.56) 110.38,27.56 H2.6
EN: length 29.1
  Top Layer w0.813: U1.3 107.09,13.01 111.55,17.47 111.55,36.37 R2.2
GPIO0: length 85
  Top Layer w0.813: v1(88.51,17.68) 89.18,17.01 U1.12 ; R1.2 95.83,37.18 87.7,29.06 v1(87.7,22.55) ; v1(57.63,64.82) 59.25,64.82 61.69,62.38 61.69,60.75 v1(66.57,55.88)
  Bottom Layer w0.813: v1(88.51,17.68) 87.7,18.49 v1(87.7,22.55) 66.57,43.69 v1(66.57,55.88) ; v1(57.63,64.82) 57.63,66.98 H1.2
GPIO2: length 110.7
  Top Layer w0.813: U1.11 55.47,19.01 35.57,38.91 v1(35.57,41.35)
  Bottom Layer w0.813: v1(35.57,41.35) 12.81,64.11 5.5,64.11 U3.3
GPIO9: length 26
  Top Layer w0.813: v1(102.05,25.94) 102.05,26.34 101.65,26.75 100.43,26.75 98.92,25.24 U1.19
  Bottom Layer w0.813: v1(102.05,25.94) 103.68,24.31 108.56,24.31 H2.4
GPIO10: length 26.7
  Top Layer w0.813: v1(101.04,21.16) 99.26,21.16 96.92,23.5 U1.20 ; v1(109.17,13.03) 109.98,12.22 H2.3
  Bottom Layer w0.813: v1(109.17,13.03) v1(101.04,21.16)
GPIO12: length 111.3
  Top Layer w0.813: v1(83.13,11.25) 52.25,11.25 U6.3 42.23,2.31 R9.2 ; U1.6 103.9,19.01 100.59,15.7 100.59,14.89 v1(103.03,12.45)
  Bottom Layer w0.813: v1(83.13,11.25) 85.57,8.81 103.47,8.81 104.28,9.62 104.28,11.2 v1(103.03,12.45)
GPIO13: length 94.1
  Top Layer w0.813: v1(53.51,16.71) 38.07,32.15 R10.2 ; U1.7 105,20.54 103.38,20.54 99.31,16.48 v1(99.31,14.04) ; v1(96.88,12.42) 91.77,7.31 75.74,7.31 U7.3 70.41,2.89 70.41,6.96 67.97,9.4 v1(60.01,9.4)
  Bottom Layer w0.813: v1(60.01,9.4) 53.51,15.9 v1(53.51,16.71) ; v1(99.31,14.04) 97.69,12.42 v1(96.88,12.42)
GPIO14: length 145.1
  Top Layer w0.813: U1.5 106.66,17.01 107.91,18.26 107.91,42.64 104.66,45.9 v1(100.38,45.9) ; v1(58.12,52.4) 65.43,52.4 70.31,57.27 v1(70.31,58.9)
  Bottom Layer w0.813: v1(58.12,52.4) 35.36,29.64 24.79,29.64 23.24,28.09 R8.2 ; v1(100.38,45.9) 93.07,45.9 74.37,64.59 ; 74.37,64.59 74.37,62.96 v1(70.31,58.9) ; 74.37,64.59 U5.3
GPIO15: length 131.5
  Top Layer w0.813: 86.12,21.01 U1.10 ; 86.12,21.01 v1(55.24,21.01) ; 86.12,21.01 86.12,29.95 v1(89.38,33.2)
  Bottom Layer w0.813: U2.3 4.13,5.66 17.13,5.66 32.48,21.01 v1(55.24,21.01) ; v1(89.38,33.2) 91,31.58 108.59,31.58 R4.2
GPIO16: length 125.9
  Top Layer w0.813: v1(69.67,44.73) 47.72,44.73 v1(44.47,47.98) ; v1(102.18,15.47) 105.01,15.47 U1.4
  Bottom Layer w0.813: U4.3 44.47,67.35 v1(44.47,47.98) 34.3,37.81 24.15,37.81 23.34,36.99 23.34,34.97 R7.2 ; v1(69.67,44.73) 98.93,15.47 v1(102.18,15.47)
MISO: length 24.8
  Top Layer w0.813: v1(100.92,25.55) U1.18
  Bottom Layer w0.813: v1(100.92,25.55) 100.53,25.93 100.53,26.75 101.34,27.56 102.16,27.56 103.78,25.93 109.47,25.93 H2.5
MOSI: length 29.7
  Top Layer w0.813: U1.21 94.92,23.5 v1(95.74,22.68)
  Bottom Layer w0.813: H2.2 105.1,22.68 v1(95.74,22.68)
RST: length 33.8
  Top Layer w0.813: R3.2 95.96,31.11 v1(95.14,30.3) ; v1(107.09,9.41) 105.87,9.41 U1.1
  Bottom Layer w0.813: v1(107.09,9.41) 107.09,12.66 102.46,17.3 99.21,17.3 94.33,22.17 94.33,29.49 v1(95.14,30.3)
RX: length 78.4
  Top Layer w0.813: v1(59.64,46.58) 56.39,49.83 56.39,53.08 v1(61.26,57.96) ; v1(83.21,22.23) 77.52,22.23 59.64,40.11 v1(59.64,41.23) ; v1(88.09,11.66) 88.74,11.01 U1.15 ; H1.5 v1(64.52,63.65)
  Bottom Layer w0.813: v1(88.09,11.66) 88.09,14.1 83.21,18.98 v1(83.21,22.23) ; v1(61.26,57.96) 64.52,61.21 v1(64.52,63.65) ; v1(59.64,46.58) v1(59.64,41.23)
SCL: length 99
  Top Layer w0.813: v1(26.27,27.15) 40.41,13.01 U1.14
  Bottom Layer w0.813: v1(26.27,27.15) R11.1 23.83,26.34 20.17,26.34 16.92,29.59 8.79,29.59 U10.3
SCLK: length 35.8
  Top Layer w0.813: H2.1 104.14,7.13 93.03,18.25 93.03,24.2 U1.22
SDA: length 107.4
  Top Layer w0.813: U1.13 90.32,15.06 40.49,15.06 25.86,29.69 25.04,29.69 ; 25.04,29.69 21.79,26.44 21.79,25.63 23.48,25.63 25.2,23.9 ; 25.04,29.69 20.62,29.69 11.68,38.63 U10.4
TX: length 74.2
  Top Layer w0.813: U1.16 90.18,9.19 88.19,9.19 86.56,10.82 v1(86.56,11.63)
  Bottom Layer w0.813: v1(86.56,11.63) 81.69,16.51 81.69,26.26 65.29,42.66 65.29,56.33 70.31,61.35 70.31,65.28 67.87,67.71 H1.6

## Copper pours and planes (outline as drawn; the poured copper is in the pictures)
GND on Top Layer: -1.27,70.76 121.03,70.76 121.03,-1.63 -1.27,-1.63
GND on Bottom Layer: -1.14,71.02 121.16,71.02 121.16,-1.88 -1.14,-1.88

Small or netless copper shapes (teardrops, artwork), in the pictures only: 2 on Top Layer, 2 on Bottom Layer

## Text on the board
Bottom Silkscreen Layer: IO12 | IO16 | 5V | GND | IO0 | 3V3 | VIN | RX | TX | IO13 | IO14
Top Silkscreen Layer: SDA | 3V3 | GND | SCL | SCLK | MISO | MOSI | IO10 | IO16 | CS0 | by Sahas | Robodog
